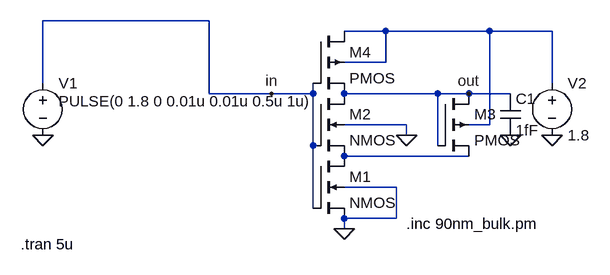
[diagram p0: schematic prop-trans.asc]
prop-trans.asc, the LTspice schematic file:
Version 4
SHEET 1 880 680
WIRE -32 0 -288 0
WIRE 240 16 176 16
WIRE 400 16 240 16
WIRE 496 16 400 16
WIRE 240 64 240 16
WIRE 240 64 176 64
WIRE -288 96 -288 0
WIRE 496 96 496 16
WIRE -32 112 -32 0
WIRE 64 112 -32 112
WIRE 128 112 128 96
WIRE 128 112 64 112
WIRE 320 112 176 112
WIRE 368 112 320 112
WIRE 432 112 368 112
WIRE 272 160 176 160
WIRE 400 160 400 16
WIRE 400 160 368 160
WIRE 272 176 272 160
WIRE 128 192 128 112
WIRE 320 192 320 112
WIRE 368 208 176 208
WIRE 256 256 176 256
WIRE 128 288 128 192
WIRE 256 304 256 256
WIRE 256 304 176 304
WIRE 176 320 176 304
FLAG 496 176 0
FLAG 432 176 0
FLAG 64 112 in
FLAG 368 112 out
FLAG 272 176 0
FLAG 176 320 0
FLAG -288 176 0
SYMBOL nmos4 128 208 R0
SYMATTR InstName M1
SYMATTR Value2 l=100n w=180n
SYMBOL nmos4 128 112 R0
SYMATTR InstName M2
SYMATTR Value2 l=100n w=180n
SYMBOL pmos4 320 112 R0
SYMATTR InstName M3
SYMATTR Value2 l=100n w=300n
SYMBOL pmos4 128 16 R0
SYMATTR InstName M4
SYMATTR Value2 l=100n w=300n
SYMBOL voltage 496 80 R0
SYMATTR InstName V2
SYMATTR Value 1.8
SYMBOL cap 416 112 R0
SYMATTR InstName C1
SYMATTR Value 1fF
SYMBOL voltage -288 80 R0
WINDOW 3 24 44 Left 2
WINDOW 123 0 0 Left 0
WINDOW 39 0 0 Left 0
SYMATTR InstName V1
SYMATTR Value PULSE(0 1.8 0 0.01u 0.01u 0.5u 1u)
TEXT 272 312 Left 2 !.inc 90nm_bulk.pm
TEXT -322 344 Left 2 !.tran 5u

The netlist it stands for:
* prop-trans.asc
M1 N002 in 0 0 NMOS l=100n w=180n
M2 out in N002 0 NMOS l=100n w=180n
M3 out out N002 N001 PMOS l=100n w=300n
M4 N001 in out N001 PMOS l=100n w=300n
V2 N001 0 1.8
C1 out 0 1fF
V1 in 0 PULSE(0 1.8 0 0.01u 0.01u 0.5u 1u)
.model NMOS NMOS
.model PMOS PMOS
.lib standard.mos
.inc 90nm_bulk.pm
.tran 5u
.backanno
.end